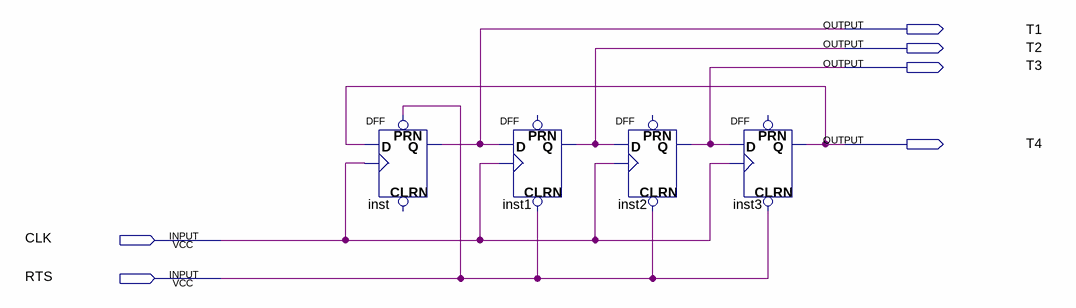
[diagram p0: schematic sheet]
// Quartus schematic generator.bdf as structural Verilog: 4 symbols, 6 pins
module generator (
  input  CLK,
  input  RTS,
  output T1,
  output T2,
  output T3,
  output T4
);

  DFF inst (.CLK(CLK), .D(T4), .PRN(RTS), .Q(T1));  // open: CLRN
  DFF inst1 (.CLRN(RTS), .CLK(CLK), .D(T1), .Q(T2));  // open: PRN
  DFF inst2 (.CLRN(RTS), .CLK(CLK), .D(T2), .Q(T3));  // open: PRN
  DFF inst3 (.CLRN(RTS), .CLK(CLK), .D(T3), .Q(T4));  // open: PRN
endmodule
